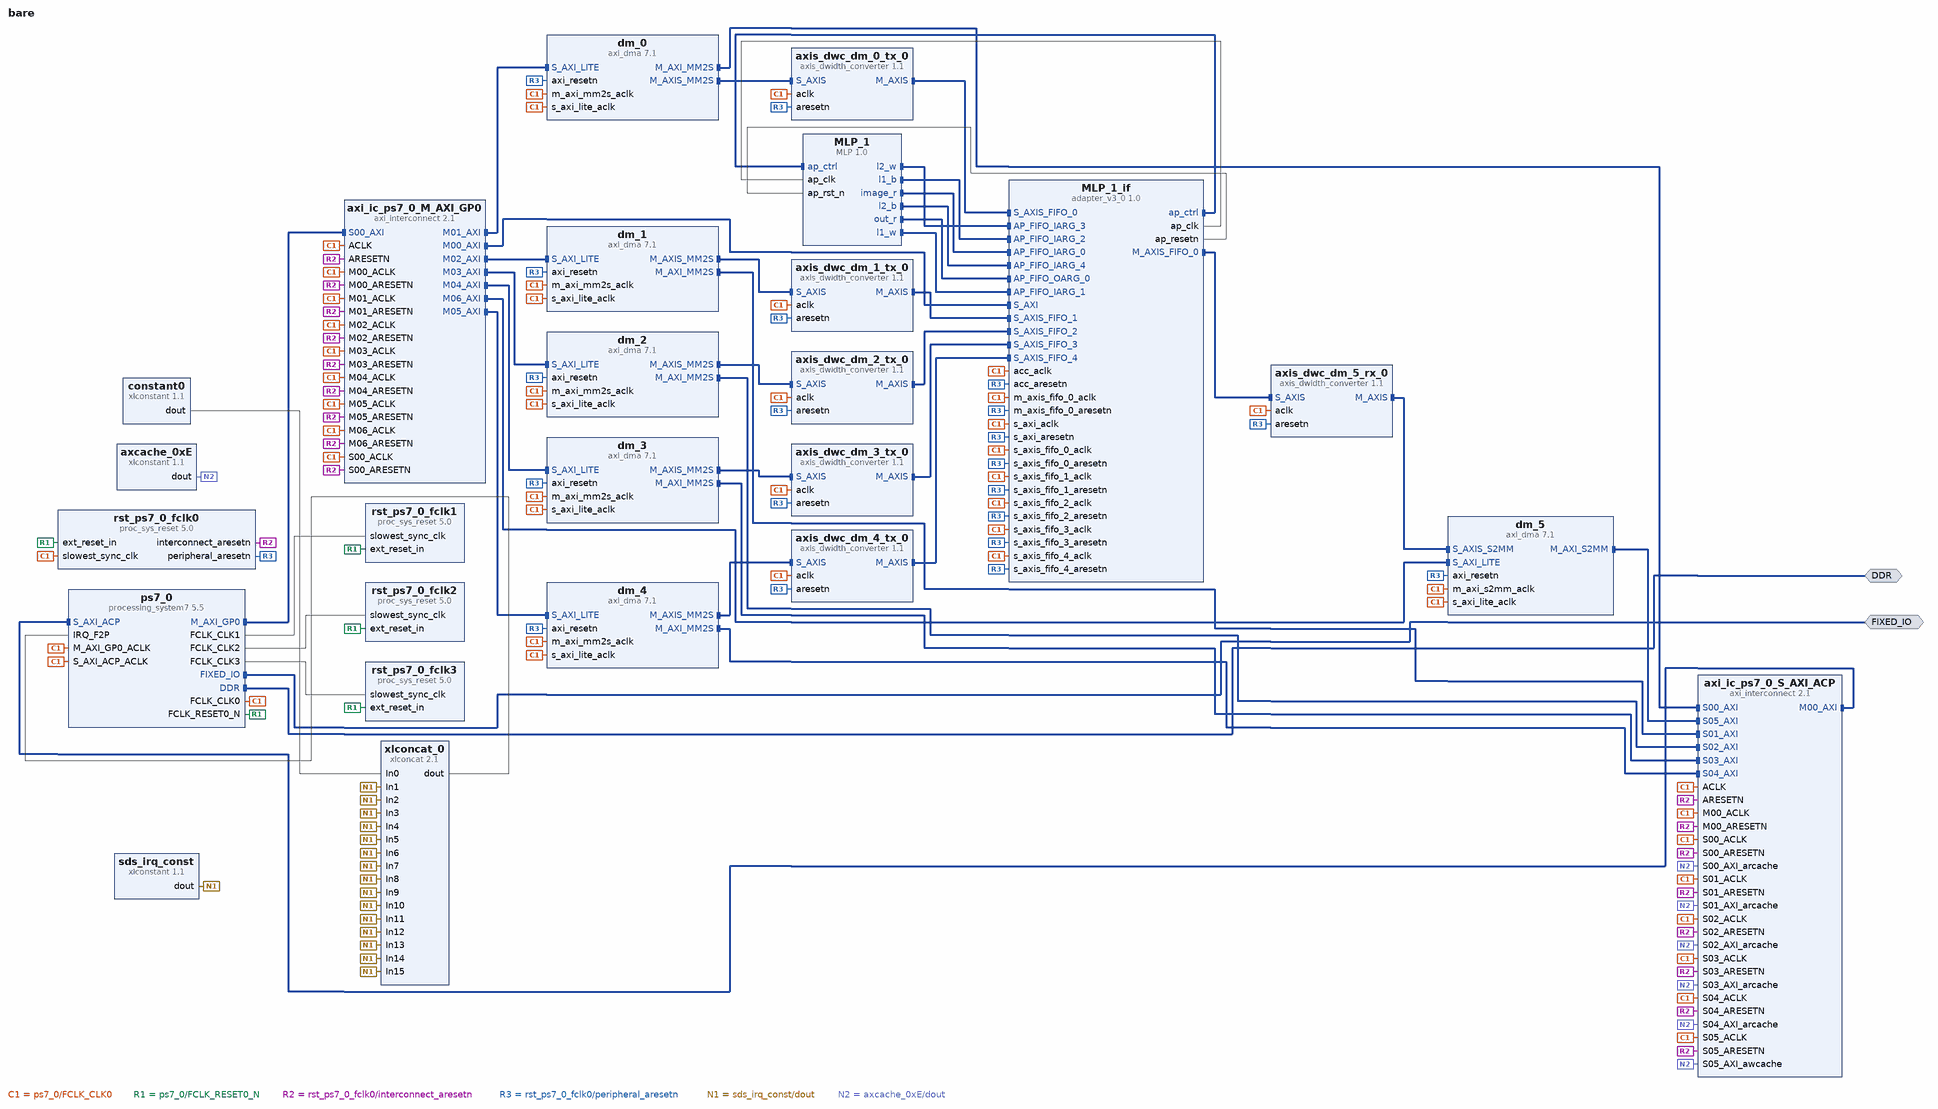
[diagram p0: block diagram of the top level]
# Vivado block design bare, xc7z020clg400-1, Vivado 2018.3
create_bd_design bare

create_bd_intf_port -mode Master -vlnv xilinx.com:interface:ddrx_rtl:1.0 DDR
create_bd_intf_port -mode Master -vlnv xilinx.com:display_processing_system7:fixedio_rtl:1.0 FIXED_IO

create_bd_cell -type ip -vlnv xilinx.com:ip:xlconstant:1.1 constant0
set_property -dict {CONFIG.CONST_VAL 0} [get_bd_cells constant0]
create_bd_cell -type ip -vlnv xilinx.com:ip:processing_system7:5.5 ps7_0
set_property -dict [list \
  CONFIG.PCW_APU_PERIPHERAL_FREQMHZ 650 \
  CONFIG.PCW_CRYSTAL_PERIPHERAL_FREQMHZ 50 \
  CONFIG.PCW_ENET0_ENET0_IO {MIO 16 .. 27} \
  CONFIG.PCW_ENET0_GRP_MDIO_ENABLE 1 \
  CONFIG.PCW_ENET0_GRP_MDIO_IO {MIO 52 .. 53} \
  CONFIG.PCW_ENET0_PERIPHERAL_ENABLE 1 \
  CONFIG.PCW_EN_CLK1_PORT 1 \
  CONFIG.PCW_EN_CLK2_PORT 1 \
  CONFIG.PCW_EN_CLK3_PORT 1 \
  CONFIG.PCW_FCLK_CLK1_BUF TRUE \
  CONFIG.PCW_FCLK_CLK2_BUF TRUE \
  CONFIG.PCW_FCLK_CLK3_BUF TRUE \
  CONFIG.PCW_FPGA0_PERIPHERAL_FREQMHZ 100 \
  CONFIG.PCW_FPGA1_PERIPHERAL_FREQMHZ 142 \
  CONFIG.PCW_FPGA2_PERIPHERAL_FREQMHZ 200 \
  CONFIG.PCW_FPGA3_PERIPHERAL_FREQMHZ 100 \
  CONFIG.PCW_FPGA_FCLK1_ENABLE 1 \
  CONFIG.PCW_FPGA_FCLK2_ENABLE 1 \
  CONFIG.PCW_FPGA_FCLK3_ENABLE 1 \
  CONFIG.PCW_GPIO_EMIO_GPIO_ENABLE 1 \
  CONFIG.PCW_GPIO_EMIO_GPIO_IO 7 \
  CONFIG.PCW_GPIO_EMIO_GPIO_WIDTH 7 \
  CONFIG.PCW_GPIO_MIO_GPIO_ENABLE 0 \
  CONFIG.PCW_I2C0_I2C0_IO EMIO \
  CONFIG.PCW_I2C0_PERIPHERAL_ENABLE 1 \
  CONFIG.PCW_I2C_PERIPHERAL_FREQMHZ 108.333336 \
  CONFIG.PCW_IRQ_F2P_INTR 1 \
  CONFIG.PCW_PERIPHERAL_BOARD_PRESET None \
  CONFIG.PCW_PRESET_BANK1_VOLTAGE {LVCMOS 1.8V} \
  CONFIG.PCW_QSPI_GRP_FBCLK_ENABLE 1 \
  CONFIG.PCW_QSPI_GRP_FBCLK_IO {MIO 8} \
  CONFIG.PCW_QSPI_GRP_SINGLE_SS_ENABLE 1 \
  CONFIG.PCW_QSPI_GRP_SINGLE_SS_IO {MIO 1 .. 6} \
  CONFIG.PCW_QSPI_PERIPHERAL_ENABLE 1 \
  CONFIG.PCW_QSPI_QSPI_IO {MIO 1 .. 6} \
  CONFIG.PCW_SD0_GRP_CD_ENABLE 1 \
  CONFIG.PCW_SD0_GRP_CD_IO {MIO 47} \
  CONFIG.PCW_SD0_GRP_WP_ENABLE 0 \
  CONFIG.PCW_SD0_PERIPHERAL_ENABLE 1 \
  CONFIG.PCW_SD0_SD0_IO {MIO 40 .. 45} \
  CONFIG.PCW_SDIO_PERIPHERAL_FREQMHZ 50 \
  CONFIG.PCW_SINGLE_QSPI_DATA_MODE x4 \
  CONFIG.PCW_UART0_PERIPHERAL_ENABLE 1 \
  CONFIG.PCW_UART0_UART0_IO {MIO 14 .. 15} \
  CONFIG.PCW_UART1_PERIPHERAL_ENABLE 0 \
  CONFIG.PCW_UART_PERIPHERAL_FREQMHZ 100 \
  CONFIG.PCW_UIPARAM_DDR_BUS_WIDTH {16 Bit} \
  CONFIG.PCW_UIPARAM_DDR_FREQ_MHZ 525 \
  CONFIG.PCW_UIPARAM_DDR_PARTNO Custom \
  CONFIG.PCW_USB0_PERIPHERAL_ENABLE 1 \
  CONFIG.PCW_USB0_USB0_IO {MIO 28 .. 39} \
  CONFIG.PCW_USE_DEFAULT_ACP_USER_VAL 1 \
  CONFIG.PCW_USE_FABRIC_INTERRUPT 1 \
  CONFIG.PCW_USE_S_AXI_ACP 1 \
] [get_bd_cells ps7_0]
# 478 more settings of ps7_0 are not shown: defaults, MIO pin electricals, DDR timing, and values the tool derives
create_bd_cell -type ip -vlnv xilinx.com:ip:proc_sys_reset:5.0 rst_ps7_0_fclk0
create_bd_cell -type ip -vlnv xilinx.com:ip:proc_sys_reset:5.0 rst_ps7_0_fclk1
create_bd_cell -type ip -vlnv xilinx.com:ip:proc_sys_reset:5.0 rst_ps7_0_fclk2
create_bd_cell -type ip -vlnv xilinx.com:ip:proc_sys_reset:5.0 rst_ps7_0_fclk3
create_bd_cell -type ip -vlnv xilinx.com:ip:xlconcat:2.1 xlconcat_0
set_property -dict {CONFIG.NUM_PORTS 16} [get_bd_cells xlconcat_0]
create_bd_cell -type ip -vlnv xilinx.com:ip:axi_dma:7.1 dm_0
set_property -dict [list \
  CONFIG.c_dlytmr_resolution 1250 \
  CONFIG.c_include_mm2s 1 \
  CONFIG.c_include_mm2s_dre 1 \
  CONFIG.c_include_mm2s_sf 1 \
  CONFIG.c_include_s2mm 0 \
  CONFIG.c_include_sg 0 \
  CONFIG.c_m_axi_mm2s_data_width 64 \
  CONFIG.c_m_axis_mm2s_tdata_width 64 \
  CONFIG.c_mm2s_burst_size 64 \
  CONFIG.c_sg_length_width 26 \
] [get_bd_cells dm_0]
create_bd_cell -type ip -vlnv xilinx.com:ip:axi_dma:7.1 dm_1
set_property -dict [list \
  CONFIG.c_dlytmr_resolution 1250 \
  CONFIG.c_include_mm2s 1 \
  CONFIG.c_include_mm2s_dre 1 \
  CONFIG.c_include_mm2s_sf 1 \
  CONFIG.c_include_s2mm 0 \
  CONFIG.c_include_sg 0 \
  CONFIG.c_m_axi_mm2s_data_width 64 \
  CONFIG.c_m_axis_mm2s_tdata_width 64 \
  CONFIG.c_mm2s_burst_size 64 \
  CONFIG.c_sg_length_width 26 \
] [get_bd_cells dm_1]
create_bd_cell -type ip -vlnv xilinx.com:ip:axi_dma:7.1 dm_2
set_property -dict [list \
  CONFIG.c_dlytmr_resolution 1250 \
  CONFIG.c_include_mm2s 1 \
  CONFIG.c_include_mm2s_dre 1 \
  CONFIG.c_include_mm2s_sf 1 \
  CONFIG.c_include_s2mm 0 \
  CONFIG.c_include_sg 0 \
  CONFIG.c_m_axi_mm2s_data_width 64 \
  CONFIG.c_m_axis_mm2s_tdata_width 64 \
  CONFIG.c_mm2s_burst_size 64 \
  CONFIG.c_sg_length_width 26 \
] [get_bd_cells dm_2]
create_bd_cell -type ip -vlnv xilinx.com:ip:axi_dma:7.1 dm_3
set_property -dict [list \
  CONFIG.c_dlytmr_resolution 1250 \
  CONFIG.c_include_mm2s 1 \
  CONFIG.c_include_mm2s_dre 1 \
  CONFIG.c_include_mm2s_sf 1 \
  CONFIG.c_include_s2mm 0 \
  CONFIG.c_include_sg 0 \
  CONFIG.c_m_axi_mm2s_data_width 64 \
  CONFIG.c_m_axis_mm2s_tdata_width 64 \
  CONFIG.c_mm2s_burst_size 64 \
  CONFIG.c_sg_length_width 26 \
] [get_bd_cells dm_3]
create_bd_cell -type ip -vlnv xilinx.com:ip:axi_dma:7.1 dm_4
set_property -dict [list \
  CONFIG.c_dlytmr_resolution 1250 \
  CONFIG.c_include_mm2s 1 \
  CONFIG.c_include_mm2s_dre 1 \
  CONFIG.c_include_mm2s_sf 1 \
  CONFIG.c_include_s2mm 0 \
  CONFIG.c_include_sg 0 \
  CONFIG.c_m_axi_mm2s_data_width 64 \
  CONFIG.c_m_axis_mm2s_tdata_width 64 \
  CONFIG.c_mm2s_burst_size 64 \
  CONFIG.c_sg_length_width 26 \
] [get_bd_cells dm_4]
create_bd_cell -type ip -vlnv xilinx.com:ip:axi_dma:7.1 dm_5
set_property -dict [list \
  CONFIG.c_dlytmr_resolution 1250 \
  CONFIG.c_include_mm2s 0 \
  CONFIG.c_include_s2mm 1 \
  CONFIG.c_include_s2mm_dre 1 \
  CONFIG.c_include_s2mm_sf 1 \
  CONFIG.c_include_sg 0 \
  CONFIG.c_m_axi_s2mm_data_width 64 \
  CONFIG.c_s2mm_burst_size 64 \
  CONFIG.c_sg_length_width 26 \
] [get_bd_cells dm_5]
create_bd_cell -type ip -vlnv xilinx.com:hls:MLP:1.0 MLP_1
create_bd_cell -type ip -vlnv xilinx.com:ip:adapter_v3_0:1.0 MLP_1_if
set_property -dict [list \
  CONFIG.C_NUM_INPUT_FIFOs 5 \
  CONFIG.C_NUM_OUTPUT_FIFOs 1 \
  CONFIG.M_AXIS_FIFO_0_BYTE_WIDTH 8 \
  CONFIG.M_AXIS_FIFO_0_DEPTH 1024 \
  CONFIG.M_AXIS_FIFO_0_DMWIDTH 8 \
  CONFIG.M_AXIS_FIFO_0_WIDTH 8 \
  CONFIG.S_AXIS_FIFO_0_BYTE_WIDTH 8 \
  CONFIG.S_AXIS_FIFO_0_DEPTH 1024 \
  CONFIG.S_AXIS_FIFO_0_DMWIDTH 8 \
  CONFIG.S_AXIS_FIFO_0_WIDTH 8 \
  CONFIG.S_AXIS_FIFO_1_BYTE_WIDTH 8 \
  CONFIG.S_AXIS_FIFO_1_DEPTH 1024 \
  CONFIG.S_AXIS_FIFO_1_DMWIDTH 8 \
  CONFIG.S_AXIS_FIFO_1_WIDTH 8 \
  CONFIG.S_AXIS_FIFO_2_BYTE_WIDTH 8 \
  CONFIG.S_AXIS_FIFO_2_DEPTH 1024 \
  CONFIG.S_AXIS_FIFO_2_DMWIDTH 8 \
  CONFIG.S_AXIS_FIFO_2_WIDTH 8 \
  CONFIG.S_AXIS_FIFO_3_BYTE_WIDTH 8 \
  CONFIG.S_AXIS_FIFO_3_DEPTH 1024 \
  CONFIG.S_AXIS_FIFO_3_DMWIDTH 8 \
  CONFIG.S_AXIS_FIFO_3_WIDTH 8 \
  CONFIG.S_AXIS_FIFO_4_BYTE_WIDTH 8 \
  CONFIG.S_AXIS_FIFO_4_DEPTH 1024 \
  CONFIG.S_AXIS_FIFO_4_DMWIDTH 8 \
  CONFIG.S_AXIS_FIFO_4_WIDTH 8 \
] [get_bd_cells MLP_1_if]
create_bd_cell -type ip -vlnv xilinx.com:ip:axi_interconnect:2.1 axi_ic_ps7_0_M_AXI_GP0
set_property -dict [list \
  CONFIG.M00_HAS_REGSLICE 1 \
  CONFIG.M01_HAS_REGSLICE 1 \
  CONFIG.M02_HAS_REGSLICE 1 \
  CONFIG.M03_HAS_REGSLICE 1 \
  CONFIG.M04_HAS_REGSLICE 1 \
  CONFIG.M05_HAS_REGSLICE 1 \
  CONFIG.M06_HAS_REGSLICE 1 \
  CONFIG.NUM_MI 7 \
  CONFIG.NUM_SI 1 \
  CONFIG.S00_HAS_REGSLICE 1 \
  CONFIG.STRATEGY 2 \
] [get_bd_cells axi_ic_ps7_0_M_AXI_GP0]
create_bd_cell -type ip -vlnv xilinx.com:ip:axi_interconnect:2.1 axi_ic_ps7_0_S_AXI_ACP
set_property -dict [list \
  CONFIG.M00_HAS_DATA_FIFO 2 \
  CONFIG.M00_HAS_REGSLICE 1 \
  CONFIG.NUM_MI 1 \
  CONFIG.NUM_SI 6 \
  CONFIG.S00_HAS_DATA_FIFO 2 \
  CONFIG.S00_HAS_REGSLICE 1 \
  CONFIG.S01_HAS_DATA_FIFO 2 \
  CONFIG.S01_HAS_REGSLICE 1 \
  CONFIG.S02_HAS_DATA_FIFO 2 \
  CONFIG.S02_HAS_REGSLICE 1 \
  CONFIG.S03_HAS_DATA_FIFO 2 \
  CONFIG.S03_HAS_REGSLICE 1 \
  CONFIG.S04_HAS_DATA_FIFO 2 \
  CONFIG.S04_HAS_REGSLICE 1 \
  CONFIG.S05_HAS_DATA_FIFO 2 \
  CONFIG.S05_HAS_REGSLICE 1 \
  CONFIG.STRATEGY 2 \
] [get_bd_cells axi_ic_ps7_0_S_AXI_ACP]
create_bd_cell -type ip -vlnv xilinx.com:ip:axis_dwidth_converter:1.1 axis_dwc_dm_0_tx_0
set_property -dict {CONFIG.M_TDATA_NUM_BYTES 1 CONFIG.S_TDATA_NUM_BYTES 8} [get_bd_cells axis_dwc_dm_0_tx_0]
create_bd_cell -type ip -vlnv xilinx.com:ip:axis_dwidth_converter:1.1 axis_dwc_dm_1_tx_0
set_property -dict {CONFIG.M_TDATA_NUM_BYTES 1 CONFIG.S_TDATA_NUM_BYTES 8} [get_bd_cells axis_dwc_dm_1_tx_0]
create_bd_cell -type ip -vlnv xilinx.com:ip:axis_dwidth_converter:1.1 axis_dwc_dm_2_tx_0
set_property -dict {CONFIG.M_TDATA_NUM_BYTES 1 CONFIG.S_TDATA_NUM_BYTES 8} [get_bd_cells axis_dwc_dm_2_tx_0]
create_bd_cell -type ip -vlnv xilinx.com:ip:axis_dwidth_converter:1.1 axis_dwc_dm_3_tx_0
set_property -dict {CONFIG.M_TDATA_NUM_BYTES 1 CONFIG.S_TDATA_NUM_BYTES 8} [get_bd_cells axis_dwc_dm_3_tx_0]
create_bd_cell -type ip -vlnv xilinx.com:ip:axis_dwidth_converter:1.1 axis_dwc_dm_4_tx_0
set_property -dict {CONFIG.M_TDATA_NUM_BYTES 1 CONFIG.S_TDATA_NUM_BYTES 8} [get_bd_cells axis_dwc_dm_4_tx_0]
create_bd_cell -type ip -vlnv xilinx.com:ip:axis_dwidth_converter:1.1 axis_dwc_dm_5_rx_0
set_property -dict {CONFIG.M_TDATA_NUM_BYTES 8 CONFIG.S_TDATA_NUM_BYTES 1} [get_bd_cells axis_dwc_dm_5_rx_0]
create_bd_cell -type ip -vlnv xilinx.com:ip:xlconstant:1.1 sds_irq_const
set_property -dict {CONFIG.CONST_VAL 0 CONFIG.CONST_WIDTH 1} [get_bd_cells sds_irq_const]
create_bd_cell -type ip -vlnv xilinx.com:ip:xlconstant:1.1 axcache_0xE
set_property -dict {CONFIG.CONST_VAL 14 CONFIG.CONST_WIDTH 4} [get_bd_cells axcache_0xE]

# ---- connections ----

connect_bd_intf_net [get_bd_intf_pins MLP_1_if/ap_ctrl] [get_bd_intf_pins MLP_1/ap_ctrl]
connect_bd_intf_net [get_bd_intf_ports FIXED_IO] [get_bd_intf_pins ps7_0/FIXED_IO]
connect_bd_intf_net [get_bd_intf_ports DDR] [get_bd_intf_pins ps7_0/DDR]
connect_bd_intf_net [get_bd_intf_pins MLP_1/l2_w] [get_bd_intf_pins MLP_1_if/AP_FIFO_IARG_3]
connect_bd_intf_net [get_bd_intf_pins MLP_1/l1_b] [get_bd_intf_pins MLP_1_if/AP_FIFO_IARG_2]
connect_bd_intf_net [get_bd_intf_pins MLP_1/image_r] [get_bd_intf_pins MLP_1_if/AP_FIFO_IARG_0]
connect_bd_intf_net [get_bd_intf_pins MLP_1/l2_b] [get_bd_intf_pins MLP_1_if/AP_FIFO_IARG_4]
connect_bd_intf_net [get_bd_intf_pins MLP_1/out_r] [get_bd_intf_pins MLP_1_if/AP_FIFO_OARG_0]
connect_bd_intf_net [get_bd_intf_pins MLP_1/l1_w] [get_bd_intf_pins MLP_1_if/AP_FIFO_IARG_1]
connect_bd_intf_net [get_bd_intf_pins dm_1/M_AXI_MM2S] [get_bd_intf_pins axi_ic_ps7_0_S_AXI_ACP/S01_AXI]
connect_bd_intf_net [get_bd_intf_pins ps7_0/M_AXI_GP0] [get_bd_intf_pins axi_ic_ps7_0_M_AXI_GP0/S00_AXI]
connect_bd_intf_net [get_bd_intf_pins dm_0/M_AXI_MM2S] [get_bd_intf_pins axi_ic_ps7_0_S_AXI_ACP/S00_AXI]
connect_bd_intf_net [get_bd_intf_pins axi_ic_ps7_0_S_AXI_ACP/M00_AXI] [get_bd_intf_pins ps7_0/S_AXI_ACP]
connect_bd_intf_net [get_bd_intf_pins axi_ic_ps7_0_M_AXI_GP0/M00_AXI] [get_bd_intf_pins MLP_1_if/S_AXI]
connect_bd_intf_net [get_bd_intf_pins dm_1/M_AXIS_MM2S] [get_bd_intf_pins axis_dwc_dm_1_tx_0/S_AXIS]
connect_bd_intf_net [get_bd_intf_pins axi_ic_ps7_0_M_AXI_GP0/M01_AXI] [get_bd_intf_pins dm_0/S_AXI_LITE]
connect_bd_intf_net [get_bd_intf_pins dm_0/M_AXIS_MM2S] [get_bd_intf_pins axis_dwc_dm_0_tx_0/S_AXIS]
connect_bd_intf_net [get_bd_intf_pins axis_dwc_dm_0_tx_0/M_AXIS] [get_bd_intf_pins MLP_1_if/S_AXIS_FIFO_0]
connect_bd_intf_net [get_bd_intf_pins axi_ic_ps7_0_M_AXI_GP0/M02_AXI] [get_bd_intf_pins dm_1/S_AXI_LITE]
connect_bd_intf_net [get_bd_intf_pins axis_dwc_dm_1_tx_0/M_AXIS] [get_bd_intf_pins MLP_1_if/S_AXIS_FIFO_1]
connect_bd_intf_net [get_bd_intf_pins dm_2/M_AXI_MM2S] [get_bd_intf_pins axi_ic_ps7_0_S_AXI_ACP/S02_AXI]
connect_bd_intf_net [get_bd_intf_pins axi_ic_ps7_0_M_AXI_GP0/M03_AXI] [get_bd_intf_pins dm_2/S_AXI_LITE]
connect_bd_intf_net [get_bd_intf_pins dm_2/M_AXIS_MM2S] [get_bd_intf_pins axis_dwc_dm_2_tx_0/S_AXIS]
connect_bd_intf_net [get_bd_intf_pins axis_dwc_dm_2_tx_0/M_AXIS] [get_bd_intf_pins MLP_1_if/S_AXIS_FIFO_2]
connect_bd_intf_net [get_bd_intf_pins dm_3/M_AXI_MM2S] [get_bd_intf_pins axi_ic_ps7_0_S_AXI_ACP/S03_AXI]
connect_bd_intf_net [get_bd_intf_pins axi_ic_ps7_0_M_AXI_GP0/M04_AXI] [get_bd_intf_pins dm_3/S_AXI_LITE]
connect_bd_intf_net [get_bd_intf_pins dm_3/M_AXIS_MM2S] [get_bd_intf_pins axis_dwc_dm_3_tx_0/S_AXIS]
connect_bd_intf_net [get_bd_intf_pins axis_dwc_dm_3_tx_0/M_AXIS] [get_bd_intf_pins MLP_1_if/S_AXIS_FIFO_3]
connect_bd_intf_net [get_bd_intf_pins dm_4/M_AXI_MM2S] [get_bd_intf_pins axi_ic_ps7_0_S_AXI_ACP/S04_AXI]
connect_bd_intf_net [get_bd_intf_pins axi_ic_ps7_0_M_AXI_GP0/M05_AXI] [get_bd_intf_pins dm_4/S_AXI_LITE]
connect_bd_intf_net [get_bd_intf_pins dm_4/M_AXIS_MM2S] [get_bd_intf_pins axis_dwc_dm_4_tx_0/S_AXIS]
connect_bd_intf_net [get_bd_intf_pins axis_dwc_dm_4_tx_0/M_AXIS] [get_bd_intf_pins MLP_1_if/S_AXIS_FIFO_4]
connect_bd_intf_net [get_bd_intf_pins dm_5/M_AXI_S2MM] [get_bd_intf_pins axi_ic_ps7_0_S_AXI_ACP/S05_AXI]
connect_bd_intf_net [get_bd_intf_pins axi_ic_ps7_0_M_AXI_GP0/M06_AXI] [get_bd_intf_pins dm_5/S_AXI_LITE]
connect_bd_intf_net [get_bd_intf_pins MLP_1_if/M_AXIS_FIFO_0] [get_bd_intf_pins axis_dwc_dm_5_rx_0/S_AXIS]
connect_bd_intf_net [get_bd_intf_pins axis_dwc_dm_5_rx_0/M_AXIS] [get_bd_intf_pins dm_5/S_AXIS_S2MM]
connect_bd_net [get_bd_pins constant0/dout] [get_bd_pins xlconcat_0/In0]
connect_bd_net [get_bd_pins ps7_0/FCLK_CLK0] \
  [get_bd_pins rst_ps7_0_fclk0/slowest_sync_clk] [get_bd_pins ps7_0/M_AXI_GP0_ACLK] [get_bd_pins ps7_0/S_AXI_ACP_ACLK] \
  [get_bd_pins dm_0/s_axi_lite_aclk] [get_bd_pins dm_0/m_axi_mm2s_aclk] [get_bd_pins dm_1/s_axi_lite_aclk] \
  [get_bd_pins dm_1/m_axi_mm2s_aclk] [get_bd_pins dm_2/s_axi_lite_aclk] [get_bd_pins dm_2/m_axi_mm2s_aclk] \
  [get_bd_pins dm_3/s_axi_lite_aclk] [get_bd_pins dm_3/m_axi_mm2s_aclk] [get_bd_pins dm_4/s_axi_lite_aclk] \
  [get_bd_pins dm_4/m_axi_mm2s_aclk] [get_bd_pins dm_5/s_axi_lite_aclk] [get_bd_pins dm_5/m_axi_s2mm_aclk] \
  [get_bd_pins MLP_1_if/s_axi_aclk] [get_bd_pins MLP_1_if/s_axis_fifo_0_aclk] [get_bd_pins MLP_1_if/s_axis_fifo_1_aclk] \
  [get_bd_pins MLP_1_if/s_axis_fifo_2_aclk] [get_bd_pins MLP_1_if/s_axis_fifo_3_aclk] \
  [get_bd_pins MLP_1_if/s_axis_fifo_4_aclk] [get_bd_pins MLP_1_if/m_axis_fifo_0_aclk] [get_bd_pins MLP_1_if/acc_aclk] \
  [get_bd_pins axi_ic_ps7_0_M_AXI_GP0/S00_ACLK] [get_bd_pins axi_ic_ps7_0_M_AXI_GP0/M00_ACLK] \
  [get_bd_pins axi_ic_ps7_0_M_AXI_GP0/M01_ACLK] [get_bd_pins axi_ic_ps7_0_M_AXI_GP0/M02_ACLK] \
  [get_bd_pins axi_ic_ps7_0_M_AXI_GP0/M03_ACLK] [get_bd_pins axi_ic_ps7_0_M_AXI_GP0/M04_ACLK] \
  [get_bd_pins axi_ic_ps7_0_M_AXI_GP0/M05_ACLK] [get_bd_pins axi_ic_ps7_0_M_AXI_GP0/M06_ACLK] \
  [get_bd_pins axi_ic_ps7_0_M_AXI_GP0/ACLK] [get_bd_pins axi_ic_ps7_0_S_AXI_ACP/S00_ACLK] \
  [get_bd_pins axi_ic_ps7_0_S_AXI_ACP/S01_ACLK] [get_bd_pins axi_ic_ps7_0_S_AXI_ACP/S02_ACLK] \
  [get_bd_pins axi_ic_ps7_0_S_AXI_ACP/S03_ACLK] [get_bd_pins axi_ic_ps7_0_S_AXI_ACP/S04_ACLK] \
  [get_bd_pins axi_ic_ps7_0_S_AXI_ACP/S05_ACLK] [get_bd_pins axis_dwc_dm_0_tx_0/aclk] [get_bd_pins axis_dwc_dm_1_tx_0/aclk] \
  [get_bd_pins axis_dwc_dm_2_tx_0/aclk] [get_bd_pins axis_dwc_dm_3_tx_0/aclk] [get_bd_pins axis_dwc_dm_4_tx_0/aclk] \
  [get_bd_pins axis_dwc_dm_5_rx_0/aclk] [get_bd_pins axi_ic_ps7_0_S_AXI_ACP/ACLK] \
  [get_bd_pins axi_ic_ps7_0_S_AXI_ACP/M00_ACLK]
connect_bd_net [get_bd_pins ps7_0/FCLK_CLK1] [get_bd_pins rst_ps7_0_fclk1/slowest_sync_clk]
connect_bd_net [get_bd_pins ps7_0/FCLK_CLK2] [get_bd_pins rst_ps7_0_fclk2/slowest_sync_clk]
connect_bd_net [get_bd_pins ps7_0/FCLK_CLK3] [get_bd_pins rst_ps7_0_fclk3/slowest_sync_clk]
connect_bd_net [get_bd_pins ps7_0/FCLK_RESET0_N] \
  [get_bd_pins rst_ps7_0_fclk0/ext_reset_in] [get_bd_pins rst_ps7_0_fclk1/ext_reset_in] \
  [get_bd_pins rst_ps7_0_fclk2/ext_reset_in] [get_bd_pins rst_ps7_0_fclk3/ext_reset_in]
connect_bd_net [get_bd_pins xlconcat_0/dout] [get_bd_pins ps7_0/IRQ_F2P]
connect_bd_net [get_bd_pins MLP_1_if/ap_clk] [get_bd_pins MLP_1/ap_clk]
connect_bd_net [get_bd_pins MLP_1_if/ap_resetn] [get_bd_pins MLP_1/ap_rst_n]
connect_bd_net [get_bd_pins rst_ps7_0_fclk0/interconnect_aresetn] \
  [get_bd_pins axi_ic_ps7_0_M_AXI_GP0/S00_ARESETN] [get_bd_pins axi_ic_ps7_0_M_AXI_GP0/M00_ARESETN] \
  [get_bd_pins axi_ic_ps7_0_M_AXI_GP0/M01_ARESETN] [get_bd_pins axi_ic_ps7_0_M_AXI_GP0/M02_ARESETN] \
  [get_bd_pins axi_ic_ps7_0_M_AXI_GP0/M03_ARESETN] [get_bd_pins axi_ic_ps7_0_M_AXI_GP0/M04_ARESETN] \
  [get_bd_pins axi_ic_ps7_0_M_AXI_GP0/M05_ARESETN] [get_bd_pins axi_ic_ps7_0_M_AXI_GP0/M06_ARESETN] \
  [get_bd_pins axi_ic_ps7_0_M_AXI_GP0/ARESETN] [get_bd_pins axi_ic_ps7_0_S_AXI_ACP/M00_ARESETN] \
  [get_bd_pins axi_ic_ps7_0_S_AXI_ACP/S00_ARESETN] [get_bd_pins axi_ic_ps7_0_S_AXI_ACP/S01_ARESETN] \
  [get_bd_pins axi_ic_ps7_0_S_AXI_ACP/S02_ARESETN] [get_bd_pins axi_ic_ps7_0_S_AXI_ACP/S03_ARESETN] \
  [get_bd_pins axi_ic_ps7_0_S_AXI_ACP/S04_ARESETN] [get_bd_pins axi_ic_ps7_0_S_AXI_ACP/S05_ARESETN] \
  [get_bd_pins axi_ic_ps7_0_S_AXI_ACP/ARESETN]
connect_bd_net [get_bd_pins rst_ps7_0_fclk0/peripheral_aresetn] \
  [get_bd_pins dm_0/axi_resetn] [get_bd_pins dm_1/axi_resetn] [get_bd_pins dm_2/axi_resetn] [get_bd_pins dm_3/axi_resetn] \
  [get_bd_pins dm_4/axi_resetn] [get_bd_pins dm_5/axi_resetn] [get_bd_pins MLP_1_if/s_axi_aresetn] \
  [get_bd_pins MLP_1_if/s_axis_fifo_0_aresetn] [get_bd_pins MLP_1_if/s_axis_fifo_1_aresetn] \
  [get_bd_pins MLP_1_if/s_axis_fifo_2_aresetn] [get_bd_pins MLP_1_if/s_axis_fifo_3_aresetn] \
  [get_bd_pins MLP_1_if/s_axis_fifo_4_aresetn] [get_bd_pins MLP_1_if/m_axis_fifo_0_aresetn] \
  [get_bd_pins MLP_1_if/acc_aresetn] [get_bd_pins axis_dwc_dm_0_tx_0/aresetn] [get_bd_pins axis_dwc_dm_1_tx_0/aresetn] \
  [get_bd_pins axis_dwc_dm_2_tx_0/aresetn] [get_bd_pins axis_dwc_dm_3_tx_0/aresetn] [get_bd_pins axis_dwc_dm_4_tx_0/aresetn] \
  [get_bd_pins axis_dwc_dm_5_rx_0/aresetn]
connect_bd_net [get_bd_pins sds_irq_const/dout] \
  [get_bd_pins xlconcat_0/In1] [get_bd_pins xlconcat_0/In2] [get_bd_pins xlconcat_0/In3] [get_bd_pins xlconcat_0/In4] \
  [get_bd_pins xlconcat_0/In5] [get_bd_pins xlconcat_0/In6] [get_bd_pins xlconcat_0/In7] [get_bd_pins xlconcat_0/In8] \
  [get_bd_pins xlconcat_0/In9] [get_bd_pins xlconcat_0/In10] [get_bd_pins xlconcat_0/In11] [get_bd_pins xlconcat_0/In12] \
  [get_bd_pins xlconcat_0/In13] [get_bd_pins xlconcat_0/In14] [get_bd_pins xlconcat_0/In15]
connect_bd_net [get_bd_pins axcache_0xE/dout] \
  [get_bd_pins axi_ic_ps7_0_S_AXI_ACP/S00_AXI_arcache] [get_bd_pins axi_ic_ps7_0_S_AXI_ACP/S01_AXI_arcache] \
  [get_bd_pins axi_ic_ps7_0_S_AXI_ACP/S02_AXI_arcache] [get_bd_pins axi_ic_ps7_0_S_AXI_ACP/S03_AXI_arcache] \
  [get_bd_pins axi_ic_ps7_0_S_AXI_ACP/S04_AXI_arcache] [get_bd_pins axi_ic_ps7_0_S_AXI_ACP/S05_AXI_awcache]

# ---- address map ----
assign_bd_address -offset 0x00000000 -range 512M -target_address_space [get_bd_addr_spaces dm_0/Data_MM2S] [get_bd_addr_segs ps7_0/S_AXI_ACP/ACP_DDR_LOWOCM]
assign_bd_address -offset 0xFC000000 -range 16M -target_address_space [get_bd_addr_spaces dm_0/Data_MM2S] [get_bd_addr_segs ps7_0/S_AXI_ACP/ACP_QSPI_LINEAR]
exclude_bd_addr_seg -offset 0x40000000 -range 1G -target_address_space [get_bd_addr_spaces dm_0/Data_MM2S] [get_bd_addr_segs ps7_0/S_AXI_ACP/ACP_M_AXI_GP0]
exclude_bd_addr_seg -offset 0xE0000000 -range 4M -target_address_space [get_bd_addr_spaces dm_0/Data_MM2S] [get_bd_addr_segs ps7_0/S_AXI_ACP/ACP_IOP]
assign_bd_address -offset 0x00000000 -range 512M -target_address_space [get_bd_addr_spaces dm_1/Data_MM2S] [get_bd_addr_segs ps7_0/S_AXI_ACP/ACP_DDR_LOWOCM]
assign_bd_address -offset 0xFC000000 -range 16M -target_address_space [get_bd_addr_spaces dm_1/Data_MM2S] [get_bd_addr_segs ps7_0/S_AXI_ACP/ACP_QSPI_LINEAR]
exclude_bd_addr_seg -offset 0x40000000 -range 1G -target_address_space [get_bd_addr_spaces dm_1/Data_MM2S] [get_bd_addr_segs ps7_0/S_AXI_ACP/ACP_M_AXI_GP0]
exclude_bd_addr_seg -offset 0xE0000000 -range 4M -target_address_space [get_bd_addr_spaces dm_1/Data_MM2S] [get_bd_addr_segs ps7_0/S_AXI_ACP/ACP_IOP]
assign_bd_address -offset 0x00000000 -range 512M -target_address_space [get_bd_addr_spaces dm_2/Data_MM2S] [get_bd_addr_segs ps7_0/S_AXI_ACP/ACP_DDR_LOWOCM]
assign_bd_address -offset 0xFC000000 -range 16M -target_address_space [get_bd_addr_spaces dm_2/Data_MM2S] [get_bd_addr_segs ps7_0/S_AXI_ACP/ACP_QSPI_LINEAR]
exclude_bd_addr_seg -offset 0x40000000 -range 1G -target_address_space [get_bd_addr_spaces dm_2/Data_MM2S] [get_bd_addr_segs ps7_0/S_AXI_ACP/ACP_M_AXI_GP0]
exclude_bd_addr_seg -offset 0xE0000000 -range 4M -target_address_space [get_bd_addr_spaces dm_2/Data_MM2S] [get_bd_addr_segs ps7_0/S_AXI_ACP/ACP_IOP]
assign_bd_address -offset 0x00000000 -range 512M -target_address_space [get_bd_addr_spaces dm_3/Data_MM2S] [get_bd_addr_segs ps7_0/S_AXI_ACP/ACP_DDR_LOWOCM]
assign_bd_address -offset 0xFC000000 -range 16M -target_address_space [get_bd_addr_spaces dm_3/Data_MM2S] [get_bd_addr_segs ps7_0/S_AXI_ACP/ACP_QSPI_LINEAR]
exclude_bd_addr_seg -offset 0x40000000 -range 1G -target_address_space [get_bd_addr_spaces dm_3/Data_MM2S] [get_bd_addr_segs ps7_0/S_AXI_ACP/ACP_M_AXI_GP0]
exclude_bd_addr_seg -offset 0xE0000000 -range 4M -target_address_space [get_bd_addr_spaces dm_3/Data_MM2S] [get_bd_addr_segs ps7_0/S_AXI_ACP/ACP_IOP]
assign_bd_address -offset 0x00000000 -range 512M -target_address_space [get_bd_addr_spaces dm_4/Data_MM2S] [get_bd_addr_segs ps7_0/S_AXI_ACP/ACP_DDR_LOWOCM]
assign_bd_address -offset 0xFC000000 -range 16M -target_address_space [get_bd_addr_spaces dm_4/Data_MM2S] [get_bd_addr_segs ps7_0/S_AXI_ACP/ACP_QSPI_LINEAR]
exclude_bd_addr_seg -offset 0x40000000 -range 1G -target_address_space [get_bd_addr_spaces dm_4/Data_MM2S] [get_bd_addr_segs ps7_0/S_AXI_ACP/ACP_M_AXI_GP0]
exclude_bd_addr_seg -offset 0xE0000000 -range 4M -target_address_space [get_bd_addr_spaces dm_4/Data_MM2S] [get_bd_addr_segs ps7_0/S_AXI_ACP/ACP_IOP]
assign_bd_address -offset 0x00000000 -range 512M -target_address_space [get_bd_addr_spaces dm_5/Data_S2MM] [get_bd_addr_segs ps7_0/S_AXI_ACP/ACP_DDR_LOWOCM]
assign_bd_address -offset 0xFC000000 -range 16M -target_address_space [get_bd_addr_spaces dm_5/Data_S2MM] [get_bd_addr_segs ps7_0/S_AXI_ACP/ACP_QSPI_LINEAR]
exclude_bd_addr_seg -offset 0x40000000 -range 1G -target_address_space [get_bd_addr_spaces dm_5/Data_S2MM] [get_bd_addr_segs ps7_0/S_AXI_ACP/ACP_M_AXI_GP0]
exclude_bd_addr_seg -offset 0xE0000000 -range 4M -target_address_space [get_bd_addr_spaces dm_5/Data_S2MM] [get_bd_addr_segs ps7_0/S_AXI_ACP/ACP_IOP]
assign_bd_address -offset 0x40400000 -range 64K -target_address_space [get_bd_addr_spaces ps7_0/Data] [get_bd_addr_segs dm_0/S_AXI_LITE/Reg]
assign_bd_address -offset 0x40410000 -range 64K -target_address_space [get_bd_addr_spaces ps7_0/Data] [get_bd_addr_segs dm_1/S_AXI_LITE/Reg]
assign_bd_address -offset 0x40420000 -range 64K -target_address_space [get_bd_addr_spaces ps7_0/Data] [get_bd_addr_segs dm_2/S_AXI_LITE/Reg]
assign_bd_address -offset 0x40430000 -range 64K -target_address_space [get_bd_addr_spaces ps7_0/Data] [get_bd_addr_segs dm_3/S_AXI_LITE/Reg]
assign_bd_address -offset 0x40440000 -range 64K -target_address_space [get_bd_addr_spaces ps7_0/Data] [get_bd_addr_segs dm_4/S_AXI_LITE/Reg]
assign_bd_address -offset 0x40450000 -range 64K -target_address_space [get_bd_addr_spaces ps7_0/Data] [get_bd_addr_segs dm_5/S_AXI_LITE/Reg]
assign_bd_address -offset 0x43C00000 -range 64K -target_address_space [get_bd_addr_spaces ps7_0/Data] [get_bd_addr_segs MLP_1_if/S_AXI/reg0]

validate_bd_design
save_bd_design
